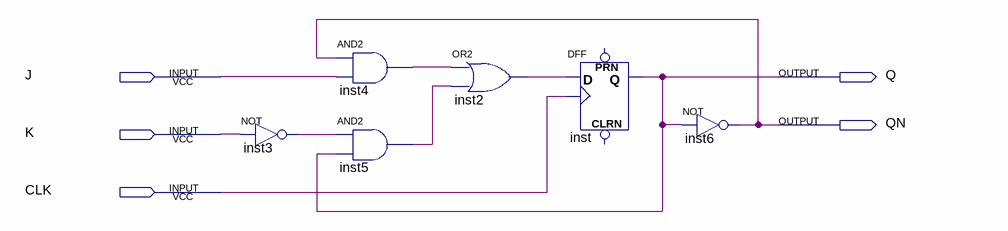
[diagram p0: schematic sheet]
// Quartus schematic hw3-1.bdf as structural Verilog: 6 symbols, 5 pins
module \hw3-1  (
  input  J,
  input  K,
  input  CLK,
  output Q,
  output QN
);

  wire inst2_out, inst3_out, inst4_out, inst5_out;

  not inst3 (inst3_out, K);
  and inst4 (inst4_out, QN, J);
  and inst5 (inst5_out, inst3_out, Q);
  or inst2 (inst2_out, inst4_out, inst5_out);
  DFF inst (.CLK(CLK), .D(inst2_out), .Q(Q));  // open: CLRN, PRN
  not inst6 (QN, Q);
endmodule
